# Altium project MP8412_module.PrjPcb
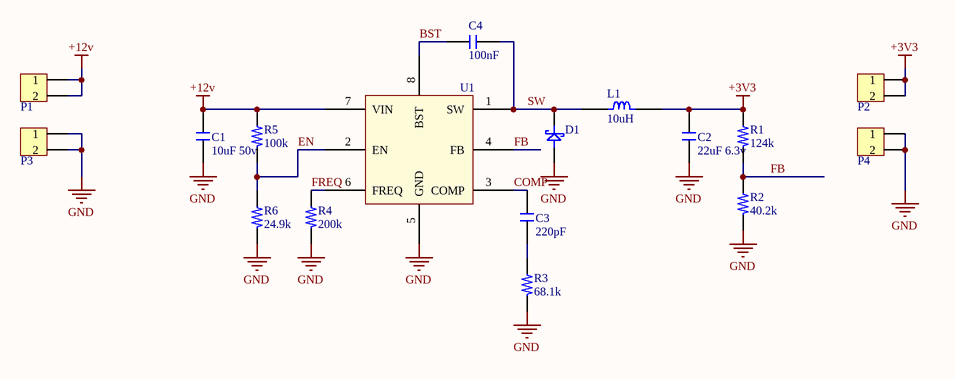
[diagram p0: Sch.SchDoc]
1 sheet, 17 parts. Net scope: global (net labels, ports and power ports of the same name join across sheets).
Board file: PCB.PcbDoc

## Sheet Sch.SchDoc
size Letter; SheetNumber: 1; SheetTotal: 1

### Parts
C1  10uF 50v  [C805]
C2  22uF 6.3v  [C805]
C3  220pF  [C805]
C4  100nF  [C805]
D1  SS34  [SS14(SMA)]  (value not drawn)
L1  10uH  [Inductor 12x12]
P1  Pin Header 2x1,2.54mm  [PCBComponent_1]  (value not drawn)
P2  Pin Header 2x1,2.54mm  [PCBComponent_1]  (value not drawn)
P3  Pin Header 2x1,2.54mm  [PCBComponent_1]  (value not drawn)
P4  Pin Header 2x1,2.54mm  [PCBComponent_1]  (value not drawn)
R1  124k  [R805]
R2  40.2k  [R805]
R3  68.1k  [R805]
R4  200k  [R805]
R5  100k  [R805]
R6  24.9k  [R805]
U1  MP1584EN-LF  [MP1584]  (value not drawn)

### Nets
+3V3: C2.2 L1.2 P2.1 P2.2 R1.1
+12v: C1.2 P1.1 P1.2 R5.1 U1.7(VIN)
GND: C1.1 C2.1 D1.A P3.1 P3.2 P4.1 P4.2 R2.2 R3.2 R4.2 R6.2 U1.5(GND)
BST: C4.1 U1.8(BST)
COMP: C3.2 U1.3(COMP)
EN: R5.2 R6.1 U1.2(EN)
FB: R1.2 R2.1 U1.4(FB)
FREQ: R4.1 U1.6(FREQ)
SW: C4.2 D1.K L1.1 U1.1(SW)
NetC3_1: C3.1 R3.1

### Library data of the parts
C1-C4 = C0805
D1 = SS14(DO-214AA)
L1 = Inductor 12x12
R1-R6 = R0805
U1 = MP1584EN-LF: Switching Voltage Regulators 3A 1.5MHz 28V Nonsync Buck; Manufacturer: Monolithic Power Systems; Output Voltage: 3.3V; Output Type: Adjustable; Output Configuration: Positive; Number of Outputs: 1; Min Input Voltage: 4.5V; Min Output Voltage: 800mV; Max Output Voltage: 25V; Synchronous Rectifier: No; Manufacturer Part Number: MP1584EN-LF; RoHS: Yes; Category: Voltage Regulators - Switching; Pricing: 100=2.17040 (USD); Mount: Surface Mount; Case/Package: SOIC; Min Operating Temperature: -20°C; Max Operating Temperature: 85°C; Packaging: Tape and Reel; Package Quantity: 100; Switching Frequency: 1.5MHz; Output Current: 3A; Operating Supply Voltage: 28V; Max Input Voltage: 28V; Lead Free: Lead Free; ComponentLink1URL: http://www.mouser.com/ds/2/277/MP1584_r1.0-779241.pdf?src-supplier=Mouser; ComponentLink1Description: http://www.mouser.com/ds/2/277/MP1584_r1.0-779241.pdf?src-supplier=Mouser; ComponentLink2URL: http://www.monolithicpower.com/Portals/0/Documents/Products/Documents/datasheet/MP1584_r1.0.pdf?src-supplier=Digi-Key; ComponentLink2Description: http://www.monolithicpower.com/Portals/0/Documents/Products/Documents/datasheet/MP1584_r1.0.pdf?src-supplier=Digi-Key; ComponentLink3URL: https://www.monolithicpower.com/pub/media/document/MP1584_r1.0.pdf?src-supplier=Digi-Key; ComponentLink3Description: https://www.monolithicpower.com/pub/media/document/MP1584_r1.0.pdf?src-supplier=Digi-Key; Supplier 1: Digi-Key; Supplier Part Number 1: 1589-1861-ND